# EAGLE design basic_health (EAGLE 8.2.2)
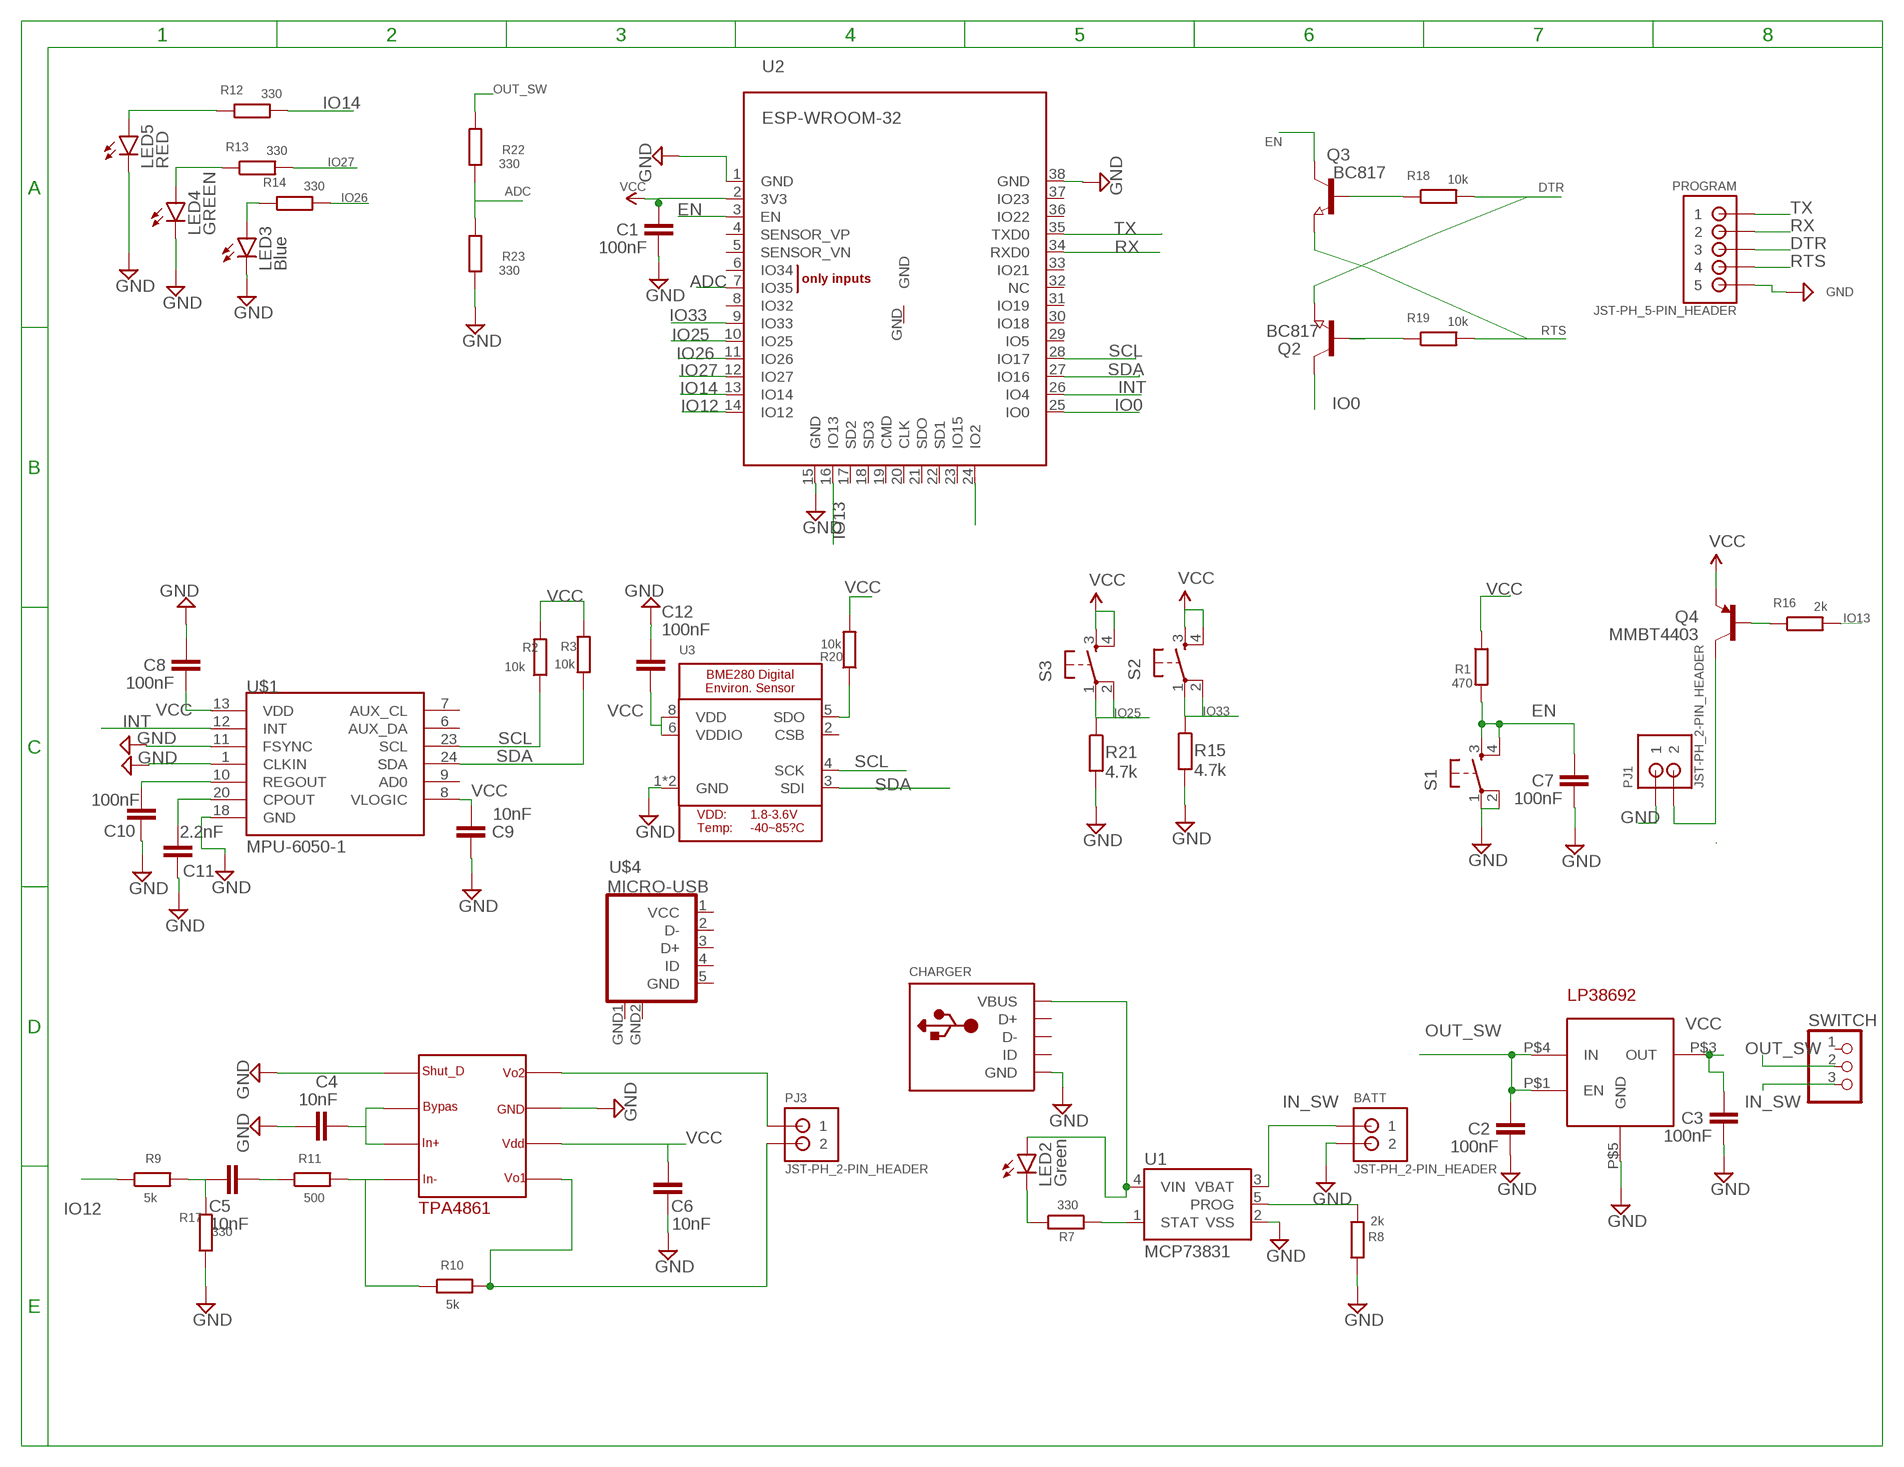
[diagram p0: schematic, sheet 1]

## Parts
BATT  JST-PH_2-PIN_HEADER  [JST_B2B-PH_HEADER]
C1  100nF  CAP0603-CAP  [0603-CAP]
C2  100nF  CAP0603-CAP  [0603-CAP]
C3  100nF  CAP0603-CAP  [0603-CAP]
C4  10nF  CAP0603-CAP  [0603-CAP]
C5  10nF  CAP0603-CAP  [0603-CAP]
C6  10nF  CAP0603-CAP  [0603-CAP]
C7  100nF  CAP0603-CAP  [0603-CAP]
C8  100nF  CAP0603-CAP  [0603-CAP]
C9  10nF  CAP0603-CAP  [0603-CAP]
C10  100nF  CAP0603-CAP  [0603-CAP]
C11  2.2nF  CAP0603-CAP  [0603-CAP]
C12  100nF  CAP0603-CAP  [0603-CAP]
CHARGER  USBMINIB  [USB-MINIB]
LED2  Green  LED-FKIT-1206  [FKIT-LED-1206]
LED3  Blue  LED-FKIT-1206  [FKIT-LED-1206]
LED4  GREEN  LED-FKIT-1206  [FKIT-LED-1206]
LED5  RED  LED-FKIT-1206  [FKIT-LED-1206]
PJ1  JST-PH_2-PIN_HEADER  [JST_B2B-PH_HEADER]
PJ3  JST-PH_2-PIN_HEADER  [JST_B2B-PH_HEADER]
PROGRAM  JST-PH_5-PIN_HEADER  [JST_B5B-PH_HEADER]
Q2  BC817  NPN-TRANSISTOR_SOT23  [SOT23]
Q3  BC817  NPN-TRANSISTOR_SOT23  [SOT23]
Q4  MMBT4403  TRANSISTOR_PNPMMBT4403  [SOT23-3]
R1  470  R-EU_R0805  [R0805]
R2  10k  R-EU_R0805  [R0805]
R3  10k  R-EU_R0805  [R0805]
R7  330  R-EU_R0805  [R0805]
R8  2k  R-EU_R0805  [R0805]
R9  5k  R-EU_R0805  [R0805]
R10  5k  R-EU_R0805  [R0805]
R11  500  R-EU_R0805  [R0805]
R12  330  R-EU_R0805  [R0805]
R13  330  R-EU_R0805  [R0805]
R14  330  R-EU_R0805  [R0805]
R15  4.7k  R-EU_R0805  [R0805]
R16  2k  R-EU_R0805  [R0805]
R17  330  R-EU_R0805  [R0805]
R18  10k  R-EU_R0805  [R0805]
R19  10k  R-EU_R0805  [R0805]
R20  10k  R-EU_R0805  [R0805]
R21  4.7k  R-EU_R0805  [R0805]
R22  330  R-EU_R0805  [R0805]
R23  330  R-EU_R0805  [R0805]
S1  TAC_SWITCHPTH  [TACTILE-PTH]
S2  TAC_SWITCHPTH  [TACTILE-PTH]
S3  TAC_SWITCHPTH  [TACTILE-PTH]
SWITCH  PINHD-1X3/90  [1X03/90]
U1  MCP73831  [SOT23-5]
U2  ESP-WROOM-32  [ESP-WROOM-32]
U3  BME280  [BME280]
U$1  MPU-6050-1  [QFN-24-4MM2]
U$2  TPA4861  [SOIC8]
U$3  LP38692_3.3V  [SOT-223-4]
U$4  MICRO-USB  [MICRO-USB]

## Nets
ADC: R22.1 R23.2 U2.7(IO35)
DTR: PROGRAM.P3 Q2.2(E) R18.2
EN: C7.1 Q3.3(C) R1.2 S1.3 S1.4 U2.3(EN)
GND: BATT.P2 C1.2 C2.2 C3.2 C4.2 C6.2 C7.2 C8.1 C9.1 C10.1 C11.1 C12.1 CHARGER.GND LED3.C LED4.C LED5.C PJ1.P1 PROGRAM.P5 R8.1 R15.2 R17.1 R21.2 R23.1 S1.1 S1.2 U1.2(VSS) U2.1(GND) U2.15(GND) U2.38(GND) U3.1(GND) U3.7(GND) U$1.1(CLKIN) U$1.11(FSYNC) U$1.18(GND) U$2.P$1 U$2.P$7 U$3.P$5(GND)
IN_SW: BATT.P1 SWITCH.3 U1.3(VBAT)
INT: U2.26(IO4) U$1.12(INT)
IO0: Q2.3(C) U2.25(IO0)
IO12: R9.1 U2.14(IO12)
IO13: R16.2 U2.16(IO13)
IO14: R12.2 U2.13(IO14)
IO25: R21.1 S3.1 S3.2 U2.10(IO25)
IO26: R14.2 U2.11(IO26)
IO27: R13.2 U2.12(IO27)
IO33: R15.1 S2.1 S2.2 U2.9(IO33)
N$1: C10.2 U$1.10(REGOUT)
N$2: C11.2 U$1.20(CPOUT)
N$3: PJ1.P2 Q4.3(C)
N$4: LED4.A R13.1
N$5: LED3.A R14.1
N$6: Q4.1(B) R16.1
N$7: CHARGER.VBUS LED2.A U1.4(VIN)
N$8: R10.1 R11.2 U$2.P$4
N$10: R7.2 U1.1(STAT)
N$11: PJ3.P2 R10.2 U$2.P$5
N$12: Q3.1(B) R18.1
N$13: Q2.1(B) R19.1
N$14: LED2.C R7.1
N$15: R8.2 U1.5(PROG)
N$16: C4.1 U$2.P$2 U$2.P$3
N$17: C5.1 R11.1
N$18: PJ3.P1 U$2.P$8
N$19: C5.2 R9.2 R17.2
N$20: LED5.A R12.1
N$21: R20.1 U3.5(SDO)
N$22: U2.24(IO2)
OUT_SW: C2.1 R22.2 SWITCH.2 U$3.P$1(EN) U$3.P$4(IN)
RTS: PROGRAM.P4 Q3.2(E) R19.2
RX: PROGRAM.P2 U2.34(RXD0)
SCL: R2.1 U2.28(IO17) U3.4(SCK) U$1.23(SCL)
SDA: R3.1 U2.27(IO16) U3.3(SDI) U$1.24(SDA)
TX: PROGRAM.P1 U2.35(TXD0)
VCC: C1.1 C3.1 C6.1 C8.2 C9.2 C12.2 Q4.2(E) R1.1 R2.2 R3.2 R20.2 S2.3 S2.4 S3.3 S3.4 U2.2(3V3) U3.6(VDDIO) U3.8(VDD) U$1.8(VLOGIC) U$1.13(VDD) U$2.P$6 U$3.P$3(OUT)
Unconnected: CHARGER.D+ CHARGER.D- CHARGER.ID SWITCH.1 U2.4(SENSOR_VP) U2.5(SENSOR_VN) U2.6(IO34) U2.8(IO32) U2.17(SD2) U2.18(SD3) U2.19(CMD) U2.20(CLK) U2.21(SDO) U2.22(SD1) U2.23(IO15) U2.29(IO5) U2.30(IO18) U2.31(IO19) U2.32(NC) U2.33(IO21) U2.36(IO22) U2.37(IO23) U2.GND U3.2(CSB) U$1.6(AUX_DA) U$1.7(AUX_CL) U$1.9(AD0) U$4.2(D-) U$4.3(D+) U$4.4(ID)

## Power pins joined to a net without a drawn wire
GND: U$4.5(GND) U$4.GND1(GND) U$4.GND2(GND)
VCC: U$4.1(VCC)

## Library data of the parts
BATT PJ1 PJ3 = srg:JST-PH_2-PIN_HEADER: 2-pin JST PH Shrouded Header, top entry P/N B2B-PH-K-S Mating connector PHR-2 Mating cable assembly: Sparkfun PRT-09914 <http://www.sparkfun.com/products/9914>
C1-C12 = SparkFun-Passives:CAP: Capacitor Standard 0603 ceramic capacitor, and 0.1" leaded capacitor.
CHARGER = adafruit:USB: USB Connectors USBMINIB - Surface Mount Female Mini-B USB Connector 4UConnector: 06564 By microbuilder.eu Thru-hole RA Female Mini-B USB Connector 4UConnector: 18732 By ladyada.net
LED2-LED5 = SparkFun-LED:LED: LEDs Standard schematic elements and footprints for 5mm, 3mm, 1206, and 0603 sized LEDs. 5mm - Spark Fun Electronics SKU : COM-00529 (and others)
PROGRAM = srg:JST-PH_5-PIN_HEADER: 5-pin JST PH Shrouded Header, top entry P/N B5B-PH-K-S Mating connector PHR-5 Mating cable assembly: Sparkfun PRT-09917 <http://www.sparkfun.com/products/9917>
Q2 Q3 = semicon-smd-ipc:NPN-TRANSISTOR_: NPN TRANSISTOR
Q4 = SparkFun-DiscreteSemi:TRANSISTOR_PNP: Generic PNP BJT Double check pinouts against datasheets- not all devices are the same! MMBT3906 - 40V 200mA SOT-23 (TRANS-08052) MMBT4403 - 40V 600mA SOT-23 (TRANS-09245); PROD_ID: TRANS-09245
R1-R3 R7-R23 = resistor:R-EU_: RESISTOR, European symbol
S1-S3 = SparkFun-Retired:TAC_SWITCH: Momentary Switch Button commonly used for reset or general input. Spark Fun Electronics SKU : COM-00097 SMT- SWCH-08247
SWITCH = pinhead:PINHD-1X3: PIN HEADER
U1 = SparkFun-PowerIC:MCP73831: Miniature single cell, fully integrated Li-Ion, Li-polymer charge management controller http://ww1.microchip.com/downloads/en/DeviceDoc/20001984g.pdf IC-09995; PROD_ID: IC-09995
U2 = esp32:ESP-WROOM-32
U3 = BMP280:BME280: BME280 - Environmental Sensor (I2C + SPI)
U$1 = mpu6050:MPU-6050
U$2 = TPA4861:TPA4861
U$3 = LP38692:LP38692_3.3V
U$4 = microusb:MICRO-USB: Micro USB B connector

## Board
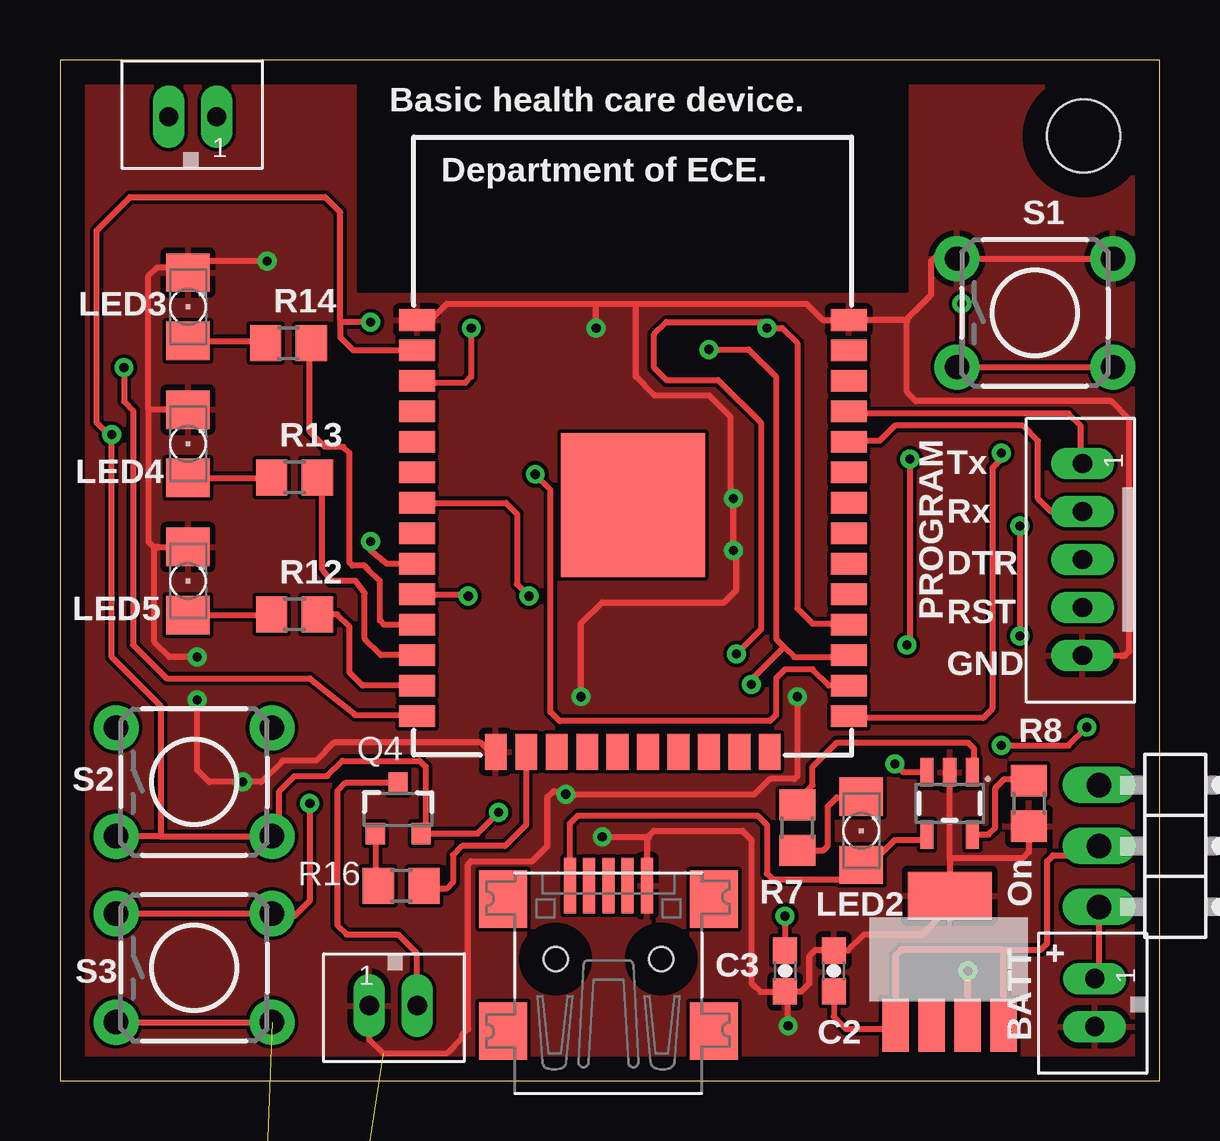
[diagram p1: board, top side]
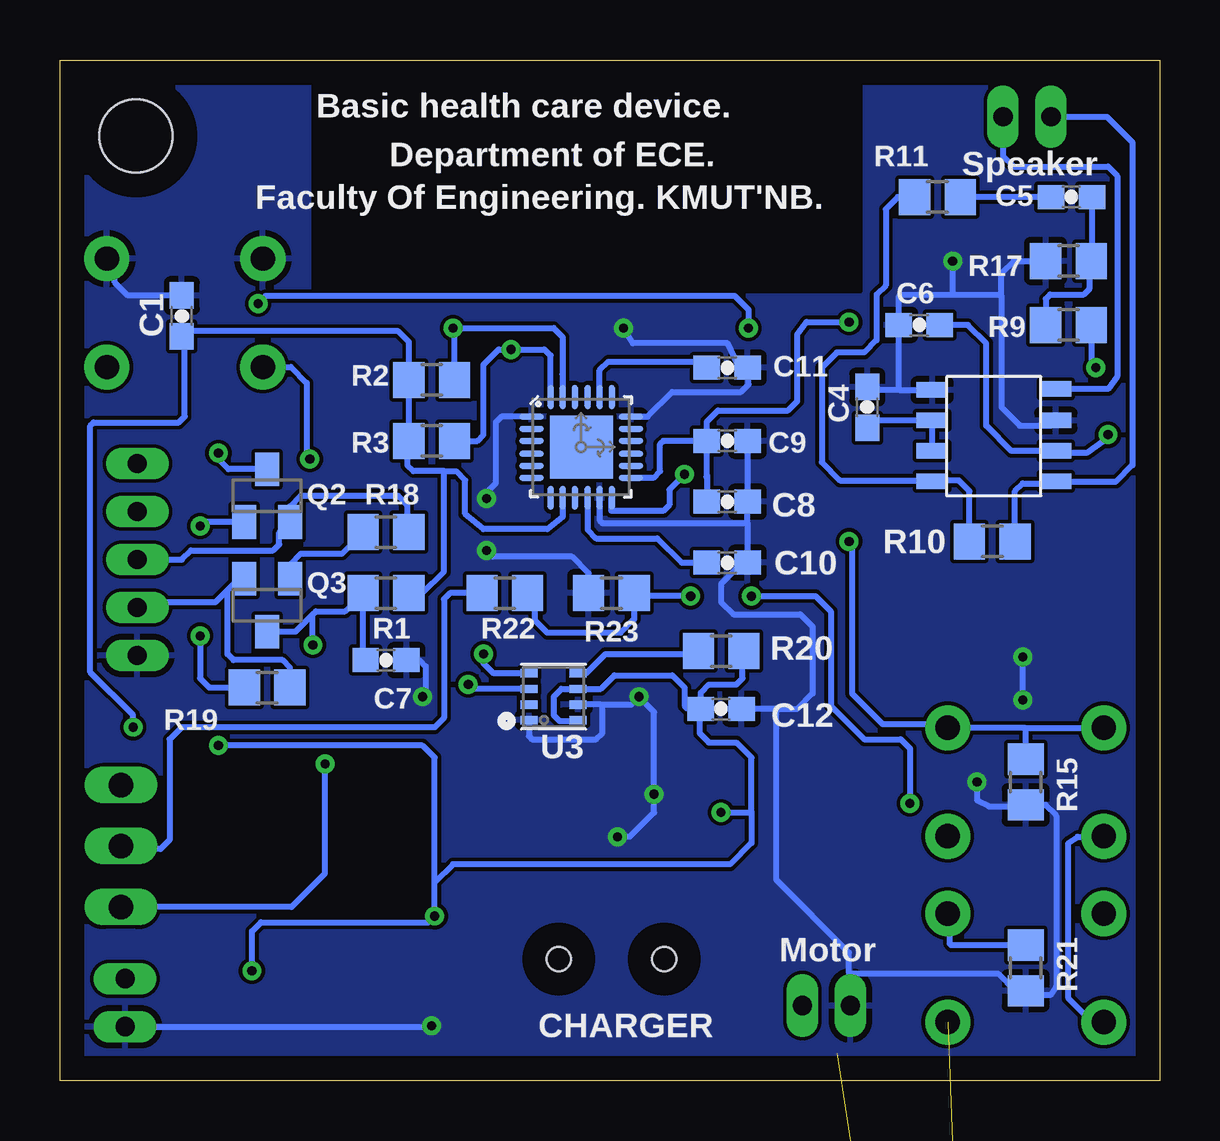
[diagram p2: board, bottom side, seen from below]

Size 45.85 x 42.55 mm. Coordinates in mm from the lower left corner, seen from the top.
Outline: 0,0 45.85,0 45.85,42.55 0,42.55 0,0
Copper layers (1*16): Top 0.035mm / dielectric 1.5mm / Bottom 0.035mm
Design rules "default": minimum track width 6mil, minimum drill 0.35mm, track to track 6mil, track to pad 6mil, pad to pad 6mil, via to via 6mil, smd to smd 6mil, copper to edge 40mil, drill to drill 6mil, minimum pad ring 10mil, minimum via ring 8mil, stop-mask expansion 4mil, vias tented up to drill 0mil, thermal gap 10mil
Holes 3.05 mm at 42.67,39.37

### Footprints (pad centres in the part's own frame; a part is rotated, then mirrored left to right if it is on the bottom)
JST_B2B-PH_HEADER = drill 0.8 long: P1 1.075,0.048; P2 -0.925,0.048
0603-CAP = smd 1.1 x 1: 1 -0.85,0; 2 0.85,0
USB-MINIB = smd 0.5 x 2.308: D+ 0,4.064; D- -0.8,4.064; GND 1.6,4.064; ID 0.8,4.064; VBUS -1.6,4.064 | smd 2 x 2.4: GND1 -4.4,-2; GND2 -4.4,3.5; GND3 4.4,3.5; GND4 4.4,-2 | hole 1: -2.2,1; 2.2,1
FKIT-LED-1206 = smd 1.6 x 1.803: A -1.422,0; C 1.422,0
JST_B5B-PH_HEADER = drill 0.8 long: P1 4,0.048; P2 2,0.048; P3 0,0.048; P4 -2,0.048; P5 -4,0.048
SOT23 = smd 1 x 1.4: 1 -0.95,-1.1; 2 0.95,-1.1; 3 0,1.1
SOT23-3 = smd 0.8 x 0.9: 1 -0.95,-1; 2 0.95,-1; 3 0,1.1
R0805 = smd 1.3 x 1.5: 1 -0.95,0; 2 0.95,0
TACTILE-PTH = drill 1.016 pad 1.88: 1 -3.251,2.261; 2 3.251,2.261; 3 -3.251,-2.261; 4 3.251,-2.261
1X03/90 = drill 1.016 long: 1 -2.54,-3.81; 2 0,-3.81; 3 2.54,-3.81
SOT23-5 = smd 0.55 x 1.2: 1 -0.95,-1.3; 2 0,-1.3; 3 0.95,-1.3; 4 0.95,1.3; 5 -0.95,1.3
ESP-WROOM-32 = smd 0.9 x 1.5: 1 7.7,9; 2 6.43,9; 3 5.16,9; 4 3.89,9; 5 2.62,9; 6 1.35,9; 7 0.08,9; 8 -1.19,9; 9 -2.46,9; 10 -3.73,9; 11 -5,9; 12 -6.27,9; 13 -7.54,9; 14 -8.81,9; 25 -8.81,-9; 26 -7.54,-9; 27 -6.27,-9; 28 -5,-9; 29 -3.73,-9; 30 -2.46,-9; 31 -1.19,-9; 32 0.08,-9; 33 1.35,-9; 34 2.62,-9; 35 3.89,-9; 36 5.16,-9; 37 6.43,-9; 38 7.7,-9 | smd 1.5 x 0.9: 15 -10.3,5.715; 16 -10.3,4.445; 17 -10.3,3.175; 18 -10.3,1.905; 19 -10.3,0.635; 20 -10.3,-0.635; 21 -10.3,-1.905; 22 -10.3,-3.175; 23 -10.3,-4.445; 24 -10.3,-5.715 | smd 6 x 6: GND 0,0
BME280 = smd 0.7 x 0.35: 1 1.025,0.975; 2 1.025,0.325; 3 1.025,-0.325; 4 1.025,-0.975; 5 -1.025,-0.975; 6 -1.025,-0.325; 7 -1.025,0.325; 8 -1.025,0.975
QFN-24-4MM2 = smd 1.016 x 0.254: 1 -2.066,1.257; 2 -2.066,0.75; 3 -2.066,0.247; 4 -2.066,-0.287; 5 -2.066,-0.792; 6 -2.066,-1.297; 13 2.086,-1.297; 14 2.086,-0.792; 15 2.086,-0.287; 16 2.086,0.247; 17 2.086,0.75; 18 2.086,1.257 | smd 0.254 x 1.016: 7 -1.267,-2.122; 8 -0.762,-2.122; 9 -0.258,-2.122; 10 0.278,-2.122; 11 0.78,-2.122; 12 1.287,-2.122; 19 1.287,2.082; 20 0.78,2.082; 21 0.278,2.082; 22 -0.258,2.082; 23 -0.762,2.082; 24 -1.267,2.082 | smd 2.616 x 2.616: P$1 0.02,-0.01
SOIC8 = smd 1.3 x 0.65: P$1 -0.6,4.405; P$2 -0.6,3.135; P$3 -0.6,1.865; P$4 -0.6,0.595; P$5 4.55,0.595; P$6 4.55,1.865; P$7 4.55,3.135; P$8 4.55,4.45
SOT-223-4 = smd 1.1 x 2.2: P$1 -2.25,-1; P$2 -0.75,-1; P$3 0.75,-1; P$4 2.25,-1 | smd 3.5 x 2: P$5 0,4.4
MICRO-USB = smd 0.4 x 1.75: 1 -1.3,4.525; 2 -0.65,4.525; 3 0,4.525; 4 0.65,4.525; 5 1.3,4.525 | drill 1.2 pad 2.54 square: GND1 -3.725,1.7; GND2 3.725,1.7 | hole 1.05: -2.425,4.73; 2.425,4.73

### Placement (x,y rotation side)
BATT  43.18,3.17 90 top
C1  40.77,31.88 90 bottom
C2  32.26,4.57 90 top
C3  30.23,4.57 270 top
C4  12.19,28.07 90 bottom
C5  3.68,36.83 0 bottom
C6  10.03,31.5 180 bottom
C7  32.26,17.53 0 bottom
C8  18.03,24.13 180 bottom
C9  18.03,26.67 180 bottom
C10  18.03,21.59 180 bottom
C11  18.03,29.72 180 bottom
C12  18.29,15.49 180 bottom
CHARGER  22.86,4.06 0 top
LED2  33.4,10.41 90 top
LED3  5.33,32.26 90 top
LED4  5.33,26.54 90 top
LED5  5.33,20.83 90 top
PJ1  13.97,3.17 180 top
PJ3  5.46,40.13 0 top
PROGRAM  42.67,21.72 90 top
Q2  37.21,24.38 0 bottom
Q3  37.21,19.81 180 bottom
Q4  14.1,11.3 0 top
R1  32.26,20.32 180 bottom
R2  30.35,29.21 180 bottom
R3  30.35,26.67 180 bottom
R7  30.73,10.54 90 top
R8  40.39,11.56 90 top
R9  3.81,31.5 180 bottom
R10  6.99,22.48 0 bottom
R11  9.27,36.83 180 bottom
R12  9.78,19.43 0 top
R13  9.78,25.15 0 top
R14  9.53,30.73 0 top
R15  5.59,12.45 270 bottom
R16  14.22,8.13 0 top
R17  3.81,34.16 0 bottom
R18  32.26,22.86 0 bottom
R19  37.21,16.38 0 bottom
R20  18.29,17.91 0 bottom
R21  5.59,4.7 270 bottom
R22  27.3,20.32 180 bottom
R23  22.86,20.32 0 bottom
S1  40.64,32 0 top
S2  5.59,12.45 0 top
S3  5.59,4.7 0 top
SWITCH  47.12,9.78 270 top
U1  37.08,11.56 180 top
U2  23.88,24 90 top
U3  25.27,16 180 bottom
U$1  24.13,26.42 0 bottom
U$2  8.89,24.38 0 bottom
U$3  37.08,3.3 0 top
U$4  9.4,-21.46 0 top  (outside the outline)

### Tracks (layer width: path | path; a pad name or v marks a point on that pad's centre or on a via)
ADC  (via drill 0.38 pad 0.76)
  Top 0.254: U2.7 18.59,24.08 19.05,23.62 19.05,20.7 v19.56,20.19
  Bottom 0.254: 21.91,20.01 R23.2 | 21.91,20.01 21.91,19.24 22.48,18.67 25.53,18.67 26.04,19.18 26.04,20 R22.1 | v19.56,20.19 21.73,20.19 21.91,20.01
DTR
  Bottom 0.254: R18.2 31.37,22.92 31.37,24 31.75,24.38 35.81,24.38 36.26,23.94 Q2.2 36.7,22.84 36.7,22.35 36.96,22.1 40.39,22.1 40.77,21.72 PROGRAM.P3
EN  (via drill 0.38 pad 0.76)
  Top 0.254: S1.4 S1.3 37.59,29.95 v37.59,32.38 | v17.14,31.37 17.14,29.34 16.89,29.08 14.96,29.08 U2.3 | v35.43,25.91 35.43,18.29 v35.31,18.16
  Bottom 0.254: C7.1 33.21,17.63 R1.2 33.97,19.56 35.18,19.56 35.31,19.43 | Q3.3 36.02,18.71 35.31,19.43 | v17.14,31.37 17.14,32.13 17.72,32.7 37.27,32.7 v37.59,32.38 | S1.3 36.22,29.74 35.56,29.08 35.56,25.91 v35.43,25.91 | v35.31,18.16 35.31,19.43
GND  (via drill 0.38 pad 0.76)  (3 unrouted)
  Top 0.254: v21.72,16 21.72,19.05 22.61,19.94 27.69,19.94 28.19,20.45 28.19,21.97 v28.07,22.1 v28.07,24.26 27.94,24.38 27.94,27.69 27.05,28.57 24.77,28.57 24,29.34 24,32.33 23.95,32.38 | 37.08,9.23 U$3.P$5 36.96,7.58 36.96,7.11 35.94,6.1 33.53,6.1 32.85,5.42 C2.2 32.22,5.46 31.5,5.46 31.24,5.21 31.24,4.06 30.9,3.72 C3.2 30.19,3.68 29.99,3.68 | 37.08,9.23 U1.2 | R8.1 40.39,9.53 40.13,9.27 37.12,9.27 37.08,9.23 | 24.46,10.02 CHARGER.GND | 24.46,10.02 24.46,10.11 24.77,10.41 28.45,10.41 28.83,10.03 28.83,4.06 29.21,3.68 29.99,3.68 | 4.05,22.25 LED5.C | 4.05,22.25 3.91,22.25 3.68,22.48 3.68,27.95 | 3.68,27.95 3.68,33.53 4.06,33.91 5.11,33.91 5.28,33.74 | 5.28,33.74 LED3.C | LED4.C 3.7,27.96 3.68,27.95 | 14.7,31.88 U2.1 15.45,31.7 16.13,32.38 22.36,32.38 | 35.26,31.7 U2.38 31.8,31.7 31.11,32.38 23.95,32.38 | 35.26,31.7 36.32,32.77 36.32,34.16 36.58,34.42 37.24,34.42 S1.1 S1.2 | 22.36,32.38 23.95,32.38 | 22.36,32.38 22.35,32.38 v22.35,31.37 | U2.15 17.92,13.7 17.53,14.1 11.43,14.1 10.67,13.34 9.27,13.34 8.38,12.45 v7.62,12.45 6.22,12.45 5.71,12.95 v5.71,15.88 | v30.35,2.29 30.35,3.32 29.99,3.68 | v30.73,16 30.73,12.7 30.61,12.57 29.59,12.57 28.96,11.94 21.21,11.94 | 21.21,11.94 21.08,11.81 v21.08,11.94 | v22.61,10.16 24.57,10.16 24.46,10.02 | PROGRAM.P5 44.39,17.72 44.58,17.91 44.58,27.56 43.81,28.32 35.69,28.32 35.31,28.7 35.31,31.66 35.26,31.7 | v8.64,34.16 5.7,34.16 5.28,33.74 | PJ1.P1 12.89,1.71 13.46,1.14 16.13,1.14 16.76,1.78 16.76,1.91 17.02,2.16 17.02,9.02 17.14,9.14 19.68,9.14 20.32,9.78 20.32,11.81 20.57,12.06 21.08,12.06 21.21,11.94 | v5.71,15.88 5.71,16 v5.71,15.88
  Top 0.254: v5.71,17.65 4.57,17.65 3.94,18.29 3.94,22.14 4.05,22.25
  Bottom 0.254: 17.16,26.57 C9.1 C8.1 17.18,23.24 | 17.18,23.24 C10.1 17.44,21.55 18.29,20.7 18.29,19.94 17.78,19.43 14.99,19.43 14.48,18.92 14.48,16.13 15.11,15.49 16,15.49 | U$1.11 23.35,23.35 23.24,23.24 17.18,23.24 | R17.1 6.1,34.16 6.6,33.66 6.6,32.71 | 6.6,32.71 6.6,28.07 5.84,27.3 4.55,27.3 U$2.P$7 | 10.87,28.79 U$2.P$1 | 10.87,28.79 12.06,28.79 C4.2 | 10.87,28.79 10.88,28.8 C6.2 10.88,32.68 10.79,32.77 8.64,32.77 | 8.64,32.77 6.66,32.77 6.6,32.71 | R23.1 23.81,21.14 24.51,21.84 27.81,21.84 v28.07,22.1 | 16,15.49 17.28,15.49 | 17.27,15.49 17.28,15.49 | U$1.1 27.45,27.67 27.69,27.43 27.69,24.89 28.19,24.38 v28.07,24.26 | v22.35,31.37 21.97,30.73 18.03,30.73 17.44,29.5 C11.1 17.14,29.3 17.14,29.02 17.46,28.7 20.32,28.7 21.35,27.67 U$1.18 21.6,27.67 | C7.2 30.86,17.53 30.61,17.27 30.61,15.75 v30.73,16 | 23.3,15.68 U3.7 | 23.3,15.68 22.04,15.68 v21.72,16 21.08,15.37 v21.08,11.94 21.08,11.18 22.1,10.16 v22.61,10.16 | U3.1 26.3,14.36 26.16,14.22 23.5,14.22 23.24,14.48 23.24,15.62 23.3,15.68 | C1.2 43.01,32.73 43.56,33.27 43.56,33.93 S1.2 | C12.1 17.28,15.49 | 16,15.49 16,8.38 12.95,5.33 12.95,4.48 | 12.95,4.48 12.95,3.19 PJ1.P1 | 12.95,4.48 12.92,4.45 6.73,4.45 6.04,3.75 R21.2 5.39,3.56 4.57,3.56 4.32,3.94 4.32,11.05 4.76,11.5 R15.2 5.65,11.43 7.11,11.43 7.62,11.68 v7.62,12.45 | BATT.P2 30.39,2.25 v30.35,2.29 | 8.64,32.77 v8.64,34.16 | v5.71,15.88 v5.71,17.65
  pour Top: 0,0 45.85,0 45.85,42.55 0,42.55 0,0.13
  pour Bottom: 0,42.55 0,0 45.85,0 45.85,42.55
IN_SW  (via drill 0.38 pad 0.76)
  Top 0.254: U1.3 35.15,12.86 v34.8,13.21 | SWITCH.3 43.31,4.42 BATT.P1
  Bottom 0.254: v34.8,13.21 34.8,8.64 36.2,7.24 SWITCH.3
INT  (via drill 0.38 pad 0.76)
  Top 0.254: U2.26 32.05,16.46 31.37,17.14 30.23,17.14 29.84,16.76 29.84,15.24 29.59,14.99 20.83,14.99 20.45,15.37 20.45,24.64 v19.81,25.27
  Bottom 0.254: v19.81,25.27 20.45,24.64 20.45,24 20.7,23.75 22.86,23.75 22.86,24.28 U$1.12
IO0  (via drill 0.38 pad 0.76)
  Top 0.254: v39.24,26.16 39.24,25.91 38.86,25.53 38.86,15.49 38.48,15.11 32.96,15.11 U2.25
  Bottom 0.254: Q2.3 38.82,25.48 39.5,26.16 v39.24,26.16
IO12  (via drill 0.38 pad 0.76)
  Top 0.254: v2.67,29.72 2.67,28.32 3.05,27.94 3.05,18.16 4.45,16.76 10.41,16.76 12.32,15.24 14.83,15.24 U2.14
  Bottom 0.254: R9.1 2.86,29.91 v2.67,29.72
IO13
  Top 0.254: U2.16 19.43,10.67 18.54,9.78 16.76,9.78 16.38,9.4 16.38,8.26 16.13,8 15.3,8 R16.2
IO14
  Top 0.254: U2.13 12.62,16.46 12.06,17.02 12.06,18.92 11.56,19.43 R12.2
IO25  (via drill 0.38 pad 0.76)
  Top 0.254: U2.10 16.97,20.27 v17.02,20.19 | S3.1 S3.2 8.94,6.86 9.78,6.86 10.41,7.49 v10.41,11.56
  Bottom 0.254: v17.02,20.19 14.35,20.19 13.72,19.56 13.72,15.62 12.32,14.22 10.79,14.22 10.41,13.84 v10.41,11.56 | 8.99,7.11 S3.2 8.76,6.88 8.76,5.71 8.7,5.65 R21.1
IO26
  Top 0.254: U2.11 13.51,19 13.34,19.18 13.34,20.83 12.83,21.34 12.7,21.46 12.19,21.46 12.06,21.59 12.06,26.16 11.81,26.42 11.05,26.42 10.41,27.05 10.41,30.67 R14.2
IO27
  Top 0.254: U2.12 13.38,17.73 12.7,18.41 12.7,20.32 12.32,20.83 11.3,20.83 10.92,21.34 10.92,24.95 R13.2
IO33  (via drill 0.38 pad 0.76)
  Top 0.254: U2.9 13.64,21.54 12.95,22.1 v12.95,22.48
  Bottom 0.254: v12.95,22.48 12.83,22.35 12.83,16.13 11.56,14.86 8.96,14.86 8.81,14.71 | 5.63,14.71 8.81,14.71 | 5.63,14.71 S2.1 | 8.81,14.71 S2.2 | R15.1 5.59,14.66 5.63,14.71
N$1
  Bottom 0.254: U$1.10 23.85,22.96 23.5,22.61 20.95,22.61 19.94,21.59 C10.2
N$2
  Bottom 0.254: C11.2 18.9,29.71 19.16,29.97 22.99,29.97 23.35,29.61 U$1.20
N$3
  Top 0.254: Q4.3 11.89,12.4 11.56,12.06 11.56,6.48 11.94,6.1 14.1,6.1 14.86,5.33 14.86,3.16 PJ1.P2
N$4
  Top 0.254: LED4.A 8.8,25.12 R13.1
N$5
  Top 0.254: LED3.A 8.47,30.84 R14.1
N$6
  Top 0.254: Q4.1 13.15,8.26 R16.1
N$7
  Top 0.254: CHARGER.VBUS 21.26,10.72 21.59,11.05 29.08,11.05 29.46,10.67 29.46,8.64 29.72,8.38 33.46,8.38 33.53,8.45 33.53,8.87 LED2.A 33.76,8.99 34.8,10.03 35.91,10.03 U1.4
N$8
  Bottom 0.254: R10.1 7.93,24.57 8.38,25.02 9.45,25.02 U$2.P$4 9.53,25.02 13.34,25.02 14.1,25.78 14.1,29.72 13.46,30.35 12.32,30.35 11.81,30.86 11.81,32.77 11.43,33.15 11.43,36.32 10.92,36.83 R11.2
N$10
  Top 0.254: R7.2 30.61,11.56 31.37,12.32 31.37,13.08 32.38,14.1 37.85,14.1 38.1,13.84 38.1,12.92 U1.1
N$11
  Bottom 0.254: R10.2 6.04,24.57 5.71,24.89 4.43,24.89 U$2.P$5 1.82,24.98 1.14,25.65 1.14,39.12 2.21,40.18 PJ3.P2
N$12
  Bottom 0.254: Q3.1 36.26,21.52 35.81,21.97 34.1,21.97 R18.1
N$13  (via drill 0.38 pad 0.76)
  Top 0.254: v40.01,23.11 v40.01,18.54
  Bottom 0.254: Q2.1 39.84,23.28 v40.01,23.11 | v40.01,18.54 40.01,16.76 39.62,16.38 R19.1
N$14
  Top 0.254: R7.1 31.82,9.59 32,9.78 32,11.43 32.38,11.81 33.38,11.81 LED2.C
N$15
  Top 0.254: U1.5 38.7,10.26 38.99,10.54 38.99,12.19 39.37,12.57 40.32,12.57 R8.2
N$16
  Bottom 0.254: U$2.P$3 U$2.P$2 11.89,27.52 C4.1
N$17
  Bottom 0.254: C5.1 R11.1
N$18
  Bottom 0.254: PJ3.P1 6.54,38.54 6.1,38.1 2.16,38.1 1.78,37.72 1.78,29.34 2.16,28.83 U$2.P$8
N$19
  Bottom 0.254: R9.2 4.76,32.58 4.57,32.77 3.17,32.77 2.92,33.02 2.92,34.1 R17.2 2.83,34.19 C5.2
N$20
  Top 0.254: LED5.A 8.8,19.41 R12.1
N$21
  Bottom 0.254: U3.5 23.92,16.98 23.11,17.78 19.36,17.78 R20.1
OUT_SW
  Top 0.254: C2.1 32.26,2.67 32.77,2.16 34.69,2.16 U$3.P$1 34.83,5.24 35.05,5.46 39.28,5.46 | 39.28,5.46 40.89,5.46 41.15,5.71 41.15,9.14 41.4,9.4 42.93,9.4 SWITCH.2 | U$3.P$4 39.33,5.41 39.28,5.46
  Bottom 0.254: R22.2 29.59,20.32 29.84,20.07 29.84,15.11 30.23,14.73 40.77,14.73 41.27,14.22 41.27,10.03 41.66,9.65 43.18,9.65 SWITCH.2
RTS
  Bottom 0.254: Q3.2 38.4,20.91 38.77,20.54 | 38.77,20.54 39.37,19.94 42.4,19.94 PROGRAM.P4 | R19.2 36.26,17.21 36.58,17.53 38.61,17.53 38.86,17.78 38.86,20.45 38.77,20.54
RX
  Top 0.254: PROGRAM.P2 41.31,23.72 41.02,24 40.77,24.26 40.77,26.67 40.13,27.3 34.8,27.3 34.16,26.67 32.92,26.67 U2.34
SCL  (via drill 0.38 pad 0.76)
  Top 0.254: 29.48,31.37 v29.46,31.37 | 29.48,31.37 30.1,31.37 30.73,30.73 30.73,19.68 31.37,19.05 32.83,19.05 U2.28 | 29.48,31.37 29.23,31.62 25.27,31.62 24.77,31.11 24.77,29.72 25.27,29.21 27.43,29.21 29.21,27.43 29.21,18.8 v28.19,17.78
  Bottom 0.254: 24.89,29.41 U$1.23 | 24.89,29.41 24.89,29.46 | 28.89,29.72 R2.1 29.4,31.18 29.46,31.24 v29.46,31.37 25.27,31.37 24.89,30.99 24.89,29.41 | 24.89,29.41 | U3.4 27.77,16.98 28.19,17.4 v28.19,17.78
SDA  (via drill 0.38 pad 0.76)
  Top 0.254: v27.05,30.48 28.7,30.48 29.84,29.34 29.84,18.41 30.18,18.07 | 30.18,18.07 30.61,17.65 32.8,17.65 U2.27 | v28.83,16.51 28.83,16.72 30.18,18.07
  Bottom 0.254: U$1.24 25.4,30.22 25.65,30.48 v27.05,30.48 27.56,30.48 28.19,29.84 28.19,26.92 28.45,26.67 R3.1 | U3.3 28.65,16.33 v28.83,16.51
TX
  Top 0.254: PROGRAM.P1 42.55,25.8 42.55,27.3 42.04,27.81 32.96,27.81 U2.35
VCC  (via drill 0.38 pad 0.76)  (1 unrouted)
  Top 0.254: 4.16,10.19 S2.3 | 4.16,10.19 S2.4 8.84,10.36 9.14,10.67 9.14,12.06 9.78,12.7 11.14,12.7 11.77,13.34 14.99,13.34 15.24,13.08 15.24,10.42 15.12,10.3 | U$3.P$3 37.83,4.43 37.85,4.45 v37.85,4.57 | v30.23,6.86 C3.1 | U2.2 12.24,30.43 11.68,30.99 11.68,31.7 | 11.68,31.7 11.68,36.2 11.05,36.83 2.92,36.83 1.52,35.43 1.52,27.43 2.03,26.92 v2.16,26.92 2.16,17.65 4.19,15.62 4.19,10.22 4.16,10.19 | v12.95,31.62 11.77,31.62 11.68,31.7 | 15.12,10.3 Q4.2 | 15.12,10.3 17.41,10.3 v18.29,11.18 | v39.24,13.97 42.04,13.97 v42.8,14.73 | S3.3 S3.4
  Bottom 0.254: 18.88,25.25 C9.2 | 18.88,25.25 C8.2 | 18.89,25.12 18.88,25.25 | U$1.8 24.89,23.5 25.53,22.99 28.19,22.99 28.96,23.62 28.96,25.02 29.34,25.4 29.82,25.4 | 29.82,25.4 31.11,25.4 31.37,25.65 31.37,26.6 R3.2 R2.2 31.3,30.8 31.75,31.24 40.55,31.24 C1.1 40.64,30.9 40.64,27.69 40.89,27.43 44.45,27.43 44.58,27.3 44.58,17.02 42.8,15.24 v42.8,14.73 | C6.1 8,31.5 7.24,30.73 7.24,27.3 6.18,26.25 U$2.P$6 4.25,26.16 3.05,26.16 2.16,26.8 v2.16,26.92 | 24.21,14.99 U3.8 24.29,14.99 25.02,14.99 25.27,15.24 25.27,16 24.95,16.33 U3.6 23.3,16.33 22.73,16.89 20.32,16.89 19.81,16.38 19.81,15.62 19.68,15.49 19.23,15.49 | 17.34,17.6 R20.2 | 17.34,17.6 17.34,17.33 | 19.15,15.57 19.18,15.79 | 19.15,15.57 C12.2 19.14,16.17 18.8,16.51 17.65,16.51 17.4,16.76 17.4,17.54 17.34,17.6 | v37.85,4.57 37.85,6.22 37.47,6.6 30.48,6.6 v30.23,6.86 | R1.1 30.73,20.32 29.84,21.21 29.84,25.38 29.82,25.4 | 19.23,15.49 19.15,15.57 | C9.2 20.7,26.67 20.83,26.54 20.83,25.4 21.11,25.12 U$1.13 | 2.57,2.44 2.69,2.44 | S2.3 2.36,10.16 3.43,10.16 3.81,9.91 3.81,3.43 2.82,2.44 2.57,2.44 | v30.23,6.86 30.23,8.26 29.46,9.02 17.91,9.02 17.02,9.91 17.02,11.22 | 19.23,15.49 19.18,15.44 19.18,14.48 18.8,14.1 17.65,14.1 17.02,13.46 17.02,11.22 | C9.2 18.88,27.47 18.41,27.94 15.49,27.94 15.11,28.32 15.11,31.11 14.73,31.62 v12.95,31.62 | v18.29,11.18 17.06,11.18 17.02,11.22 | v30.23,6.86 30.23,13.46 30.73,13.97 v39.24,13.97 | 2.57,2.44 S3.3 2.57,2.44

### Text on the board
tNames: Basic health care device. | Department of ECE. | Tx | Rx | DTR | RST | GND | On | +
bNames: Basic health care device. | Speaker | Department of ECE. | Faculty Of Engineering. KMUT'NB. | Motor